# EAGLE schematic thermostatMechanicalSingleStage (EAGLE 7.0.0)
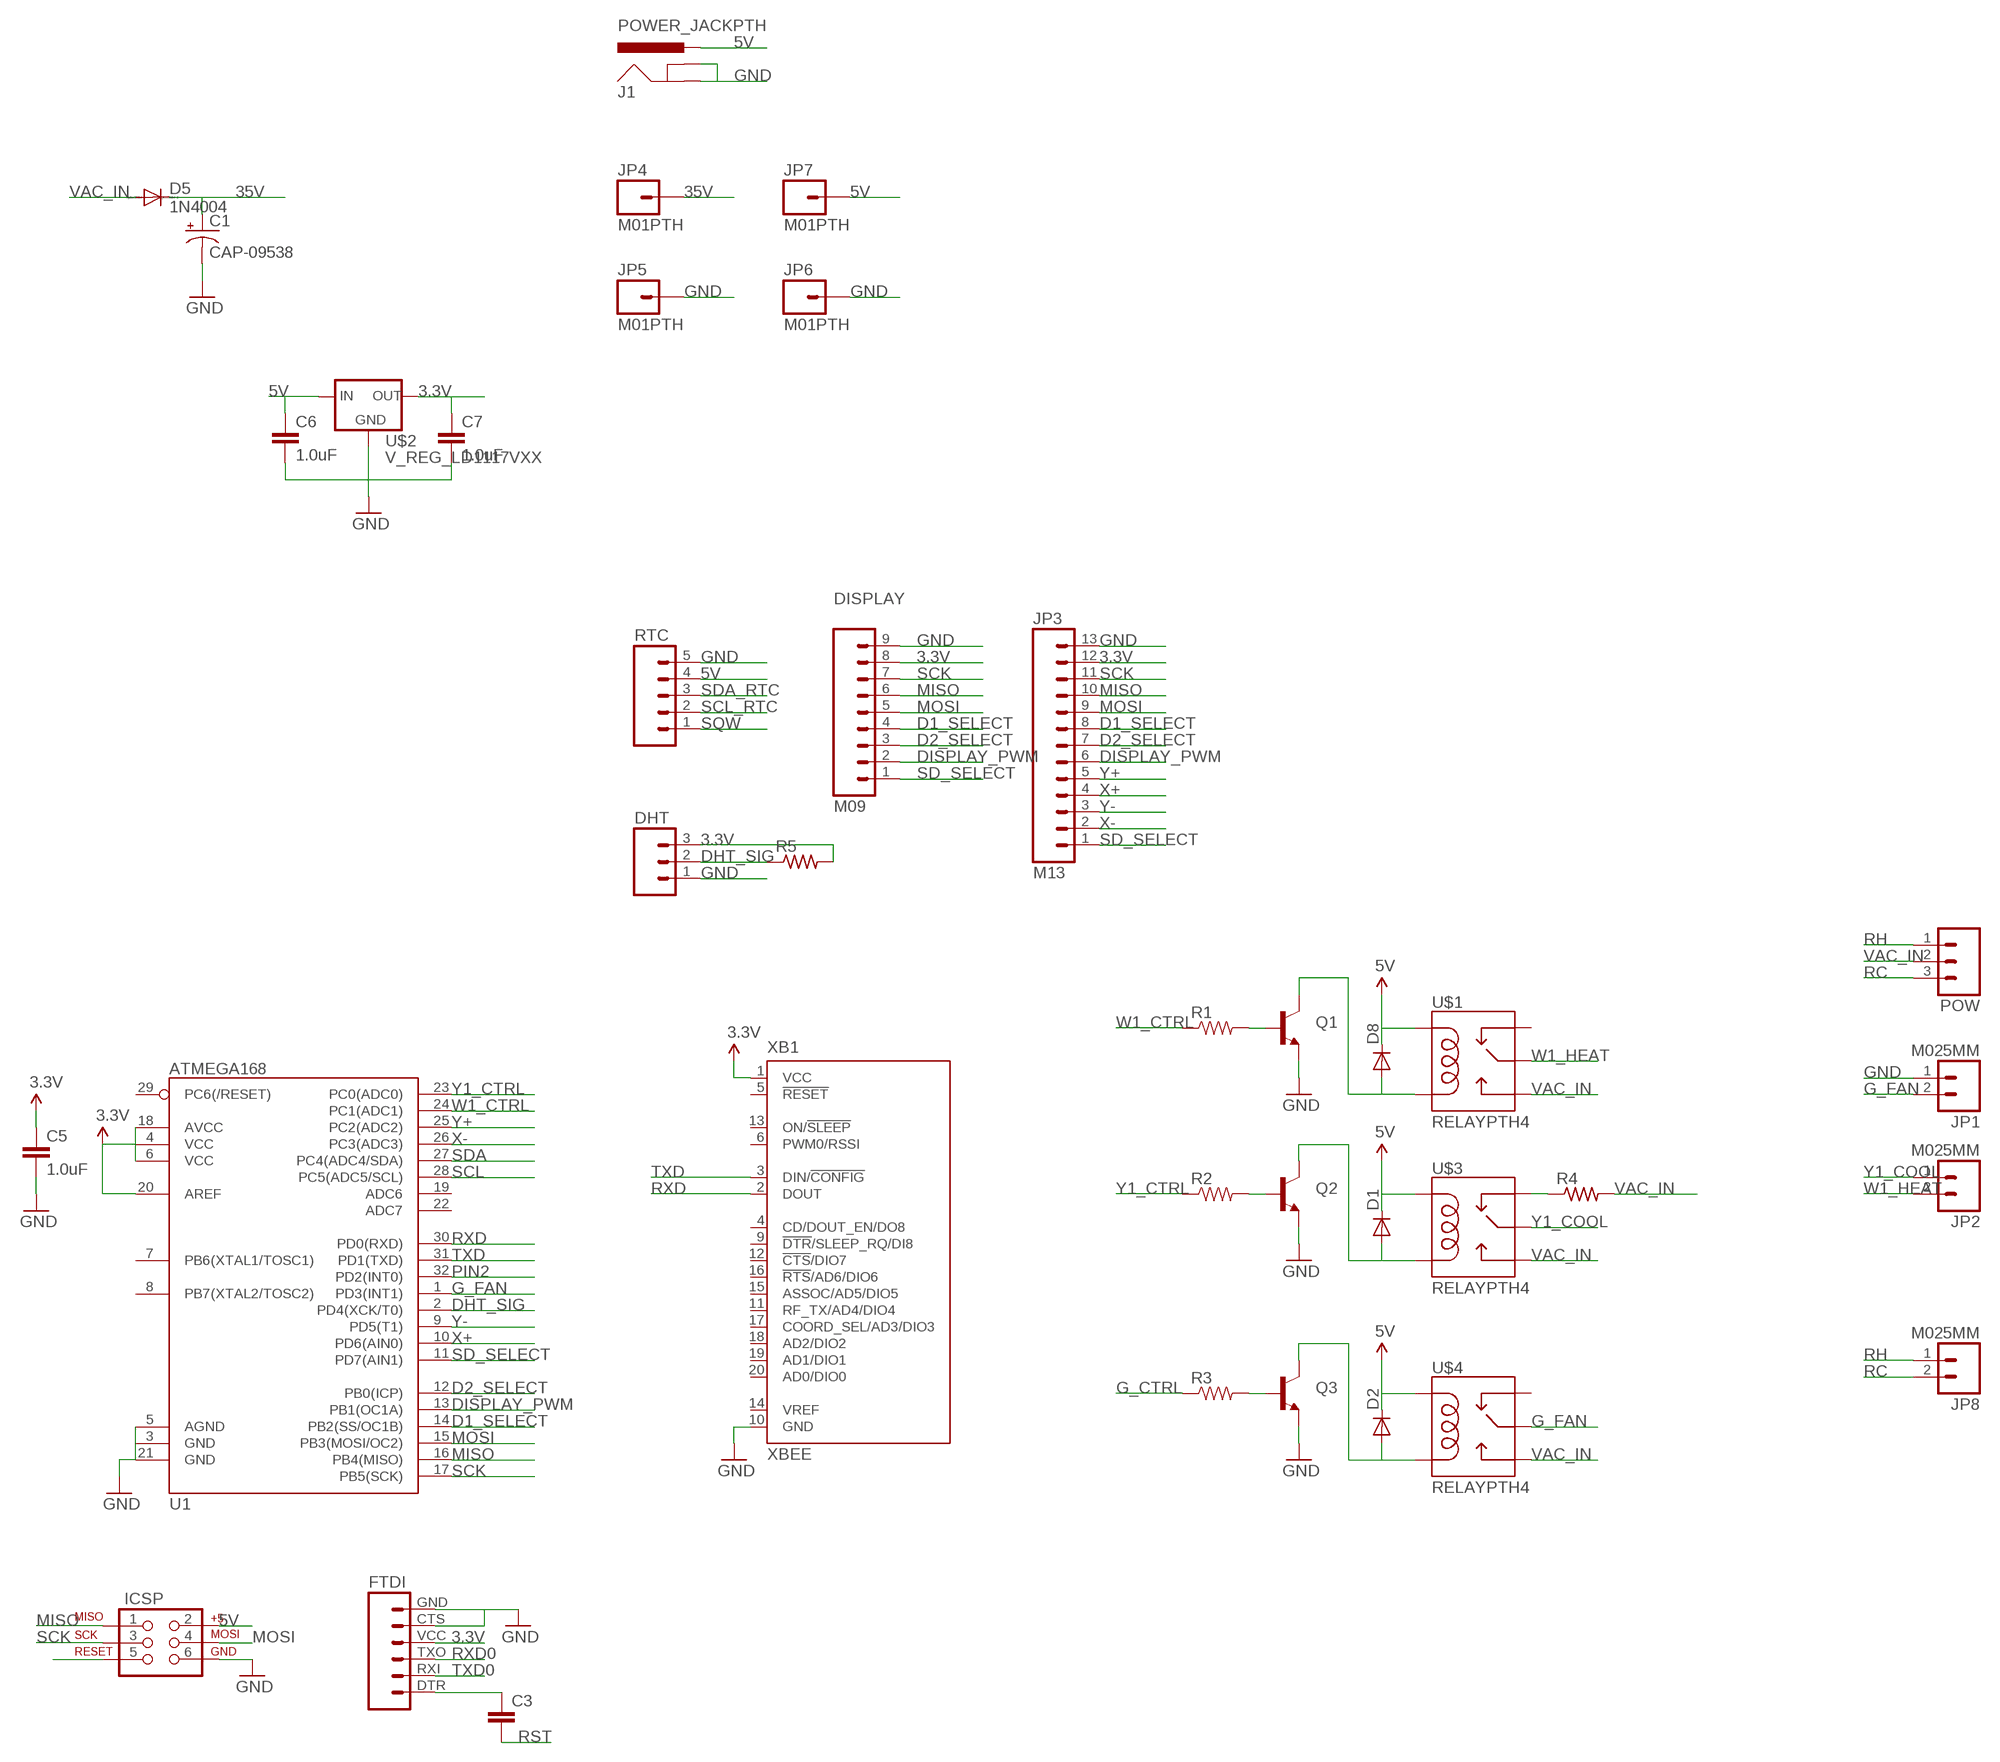
[diagram p0: schematic, sheet 1]

## Parts
C1  CAP-09538  1000UF-25V(PTH)  [CPOL-RADIAL-1000UF-25V]
C3  CAP1206  [1206]
C5  1.0uF  1.0UF50V10%(1206)  [1206]
C6  1.0uF  1.0UF50V10%(1206)  [1206]
C7  1.0uF  1.0UF50V10%(1206)  [1206]
D1  DIODE1N4148  [DIODE-1N4148]
D2  DIODE1N4148  [DIODE-1N4148]
D5  1N4004  [DO41-10]
D8  DIODE1N4148  [DIODE-1N4148]
DHT  M03PTH  [1X03]
DISPLAY  M09  [1X09]
FTDI  FTDI_BASICPTH  [FTDI_BASIC]
ICSP  AVR_SPI_PRG_6NS  [2X3-NS]
J1  POWER_JACKPTH  [POWER_JACK_PTH]
JP1  M025MM  [SCREWTERMINAL-5MM-2]
JP2  M025MM  [SCREWTERMINAL-5MM-2]
JP3  M13  [1X13]
JP4  M01PTH  [1X01]
JP5  M01PTH  [1X01]
JP6  M01PTH  [1X01]
JP7  M01PTH  [1X01]
JP8  M025MM  [SCREWTERMINAL-5MM-2]
POW  M03PTH  [1X03]
Q1  TRANSISTOR_NPNSOT23  [SOT23]
Q2  TRANSISTOR_NPNSOT23  [SOT23]
Q3  TRANSISTOR_NPNSOT23  [SOT23]
R1  RESISTOR1206  [1206]
R2  RESISTOR1206  [1206]
R3  RESISTOR1206  [1206]
R4  R-US_0204/7  [0204/7]
R5  R-US_M1206  [M1206]
RTC  M05PTH  [1X05]
U1  ATMEGA168  [TQFP32-08]
U$1  RELAYPTH4  [RELAY-JZC]
U$2  V_REG_LD1117VXX  [78XXL]
U$3  RELAYPTH4  [RELAY-JZC]
U$4  RELAYPTH4  [RELAY-JZC]
XB1  XBEE  [XBEE]

## Nets
3.3V: C5.1 C7.1 DHT.3 DISPLAY.8 FTDI.VCC JP3.12 R5.2 U1.4(VCC) U1.6(VCC) U1.18(AVCC) U1.20(AREF) U$2.GND(OUT) XB1.1(VCC)
5V: C6.1 D1.C D2.C D8.C ICSP.2 J1.PWR JP7.1 RTC.4 U$1.5(COIL1) U$2.OUT(IN) U$3.5(COIL1) U$4.5(COIL1)
35V: C1.+ D5.C JP4.1
D1_SELECT: DISPLAY.4 JP3.8 U1.14(PB2(SS/OC1B))
D2_SELECT: DISPLAY.3 JP3.7 U1.12(PB0(ICP))
DHT_SIG: DHT.2 R5.1 U1.2(PD4(XCK/T0))
DISPLAY_PWM: DISPLAY.2 JP3.6 U1.13(PB1(OC1A))
G_CTRL: R3.1
G_FAN: JP1.2 U1.1(PD3(INT1)) U$4.4(MAIN)
GND: C1.- C5.2 C6.2 C7.2 DHT.1 DISPLAY.9 FTDI.CTS FTDI.GND ICSP.6 J1.GND J1.GNDBREAK JP1.1 JP3.13 JP5.1 JP6.1 Q1.2(E) Q2.2(E) Q3.2(E) RTC.5 U1.3(GND) U1.5(AGND) U1.21(GND) U$2.IN(GND) XB1.10(GND)
MISO: DISPLAY.6 ICSP.1 JP3.10 U1.16(PB4(MISO))
MOSI: DISPLAY.5 ICSP.4 JP3.9 U1.15(PB3(MOSI/OC2))
N$1: Q2.1(B) R2.2
N$2: Q3.1(B) R3.2
N$3: D8.A Q1.3(C) U$1.1(COIL2)
N$4: D1.A Q2.3(C) U$3.1(COIL2)
N$5: D2.A Q3.3(C) U$4.1(COIL2)
N$8: Q1.1(B) R1.2
N$9: R4.1 U$3.2(NC)
N$11: C3.1 FTDI.DTR
PIN2: U1.32(PD2(INT0))
RC: JP8.2 POW.3
RH: JP8.1 POW.1
RST: C3.2 ICSP.5
RXD: U1.30(PD0(RXD)) XB1.2(DOUT)
RXD0: FTDI.TXO
SCK: DISPLAY.7 ICSP.3 JP3.11 U1.17(PB5(SCK))
SCL: U1.28(PC5(ADC5/SCL))
SCL_RTC: RTC.2
SD_SELECT: DISPLAY.1 JP3.1 U1.11(PD7(AIN1))
SDA: U1.27(PC4(ADC4/SDA))
SDA_RTC: RTC.3
SQW: RTC.1
TXD: U1.31(PD1(TXD)) XB1.3(DIN/!CONFIG)
TXD0: FTDI.RXI
VAC_IN: D5.A POW.2 R4.2 U$1.3(NO) U$3.3(NO) U$4.3(NO)
W1_CTRL: R1.1 U1.24(PC1(ADC1))
W1_HEAT: JP2.2 U$1.4(MAIN)
X+: JP3.4 U1.10(PD6(AIN0))
X-: JP3.2 U1.26(PC3(ADC3))
Y1_COOL: JP2.1 U$3.4(MAIN)
Y1_CTRL: R2.1 U1.23(PC0(ADC0))
Y+: JP3.5 U1.25(PC2(ADC2))
Y-: JP3.3 U1.9(PD5(T1))
Unconnected: U1.7(PB6(XTAL1/TOSC1)) U1.8(PB7(XTAL2/TOSC2)) U1.19(ADC6) U1.22(ADC7) U1.29(PC6(/RESET)) U$1.2(NC) U$4.2(NC) XB1.4(CD/DOUT_EN/DO8) XB1.5(!RESET) XB1.6(PWM0/RSSI) XB1.9(!DTR!/SLEEP_RQ/DI8) XB1.11(RF_TX/AD4/DIO4) XB1.12(!CTS!/DIO7) XB1.13(ON/!SLEEP) XB1.14(VREF) XB1.15(ASSOC/AD5/DIO5) XB1.16(!RTS!/AD6/DIO6) XB1.17(COORD_SEL/AD3/DIO3) XB1.18(AD2/DIO2) XB1.19(AD1/DIO1) XB1.20(AD0/DIO0)

## Library data of the parts
C1 = SparkFun-Capacitors:1000UF-25V(PTH): CAP-08070; PROD_ID: CAP-09538
C3 = SparkFun:CAP: Capacitor Standard 0603 ceramic capacitor, and 0.1" leaded capacitor.
C5-C7 = SparkFun-Capacitors:1.0UF50V10%(1206): CAP-09822; PROD_ID: CAP-09822
D1 D2 D8 = SparkFun:DIODE: Diode These are standard reverse protection diodes and small signal diodes. SMA package can handle up to about 1A. SOD-323 can handle about 200mA. What the SOD-323 package when ordering, there are some mfgs out there that are 5-pin packages.
D5 = diode:1N4004: DIODE general purpose rectifier, 1 A
DHT POW = SparkFun-Connectors:M03: Header 3 Standard 3-pin 0.1" header. Use with straight break away headers (SKU : PRT-00116), right angle break away headers (PRT-00553), swiss pins (PRT-00743), machine pins (PRT-00117), and female headers (PRT-00115). Molex polarized connector foot print use with SKU : PRT-08232 with associated crimp pins and housings.
DISPLAY = SparkFun-Connectors:M09: Header 9 Standard 9-pin 0.1" header. Use with straight break away headers (SKU : PRT-00116), right angle break away headers (PRT-00553), swiss pins (PRT-00743), machine pins (PRT-00117), and female headers (PRT-00115).
FTDI = SparkFun:FTDI_BASIC: FTDI Basic: 3.3V and 5V
ICSP = SparkFun:AVR_SPI_PRG_6: AVR ISP 6 Pin This is the reduced ISP connector for AVR programming. Common on Arduino. This footprint will take up less PCB space and can be used with a 10-pin to 6-pin adapter such as SKU: BOB-08508
J1 = SparkFun-Connectors:POWER_JACK: Power Jack This is the standard 5.5mm barrel jack for power. The PTH is the most common, proven, reliable, footprint. The Slot footprint only works if the mill layer is transmitted to the PCB fab house so be warned. Mating wall wart : TOL-00298 (and others); PROD_ID: PRT-00119
JP1 JP2 JP8 = SparkFun-Connectors:M02: Standard 2-pin 0.1" header. Use with - straight break away headers ( PRT-00116) - right angle break away headers (PRT-00553) - swiss pins (PRT-00743) - machine pins (PRT-00117) - female headers (PRT-00115) Molex polarized connector foot print use with: PRT-08233 with associated crimp pins and housings. 2.54_SCREWTERM for use with PRT-10571. 3.5mm Screw Terminal footprints for PRT-08084 5mm Screw Terminal footprints for use with PRT-08433
JP3 = SparkFun-Connectors:M13: 13-pin single row .1" header
JP4-JP7 = SparkFun-Connectors:M01: Header 1 Standard 1-pin 0.1" header. Use with straight break away headers (SKU : PRT-00116), right angle break away headers (PRT-00553), swiss pins (PRT-00743), machine pins (PRT-00117), and female headers (PRT-00115).
Q1-Q3 = SparkFun:TRANSISTOR_NPN: Transistor NPN BJT configuration in SOT23 package. MMBT2222 is the common NPN we use. Double check BCE configuration again layout.
R1-R3 = SparkFun:RESISTOR: Resistor Basic schematic elements and footprints for 0603, 1206, and PTH resistors.
R4 = rcl:R-US_: RESISTOR, American symbol
R5 = adafruit:R-US_: RESISTOR, American symbol
RTC = SparkFun-Connectors:M05: Header 5 Standard 5-pin 0.1" header. Use with straight break away headers (SKU : PRT-00116), right angle break away headers (PRT-00553), swiss pins (PRT-00743), machine pins (PRT-00117), and female headers (PRT-00115). Molex polarized connector foot print use with SKU : PRT-08230 with associated crimp pins and housings.
U1 = SparkFun-DigitalIC:ATMEGA168: Atmel 32-pin 8-bit micro, 16k flash.
U$1 U$3 U$4 = SparkFun-Electromechanical:RELAY: SPDT relay (COM-00101)
U$2 = SparkFun-PowerIC:V_REG_LD1117VXX: LD1117VXX voltage regulator. We carry the 3.3V version (COM-00526) in TO-220 package.
XB1 = maxstream:XBEE: XBee (TM) /XBee-PRO(TM) OEM RF Modules Source: MaxStream, Inc. xbee_productmanual.pdf; MPN: XBP24-Z7UIT-004; OC_FARNELL: 1751799; OC_NEWARK: 34R5507